# Altium schematic sheet aansluiting.SchDoc
size A4; SheetNumber: 3; SheetTotal: 3
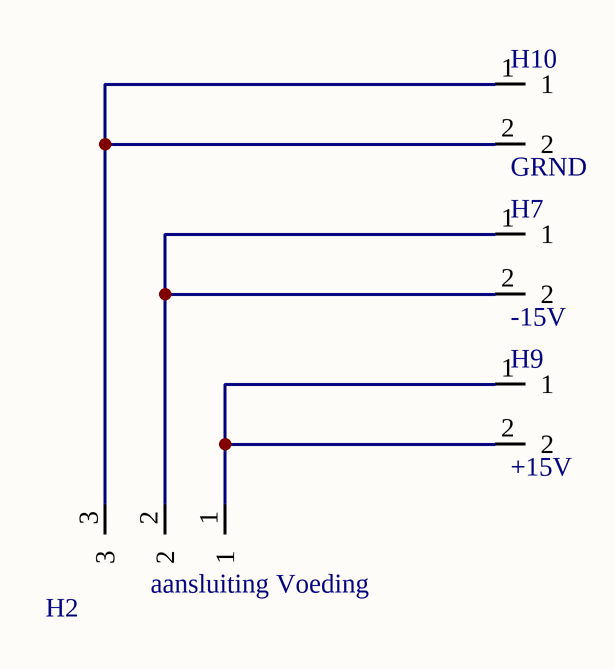
[diagram p0: aansluiting.SchDoc]

## Parts
H2  aansluiting Voeding  [header 1x3]
H7  -15V  [header 1x2]
H9  +15V  [header 1x2]
H10  GRND  [header 1x2]

## Nets
NetH2_1: H2.1 H9.1 H9.2
NetH2_2: H2.2 H7.1 H7.2
NetH2_3: H2.3 H10.1 H10.2

## Library data of the parts
H2 = header 1x3
H7 H9 H10 = header 1x2